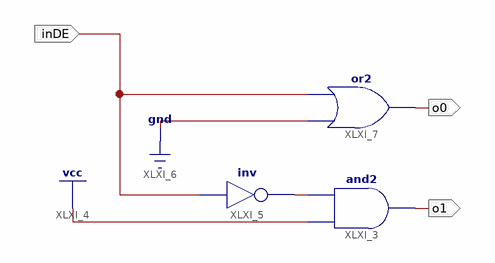
[diagram p0: schematic sheet 1]
// Xilinx ISE schematic decoder1_2_new.sch (spartan6) as structural Verilog: 3 symbols, 3 ports
module decoder1_2_new (
  input  inDE,
  output o0,
  output o1
);

  wire XLXN_10;

  and XLXI_3 (o1, 1'b1, XLXN_10);
  not XLXI_5 (XLXN_10, inDE);
  or XLXI_7 (o0, 1'b0, inDE);
endmodule
